# EAGLE design solar_hv4_1 (EAGLE 5.07)
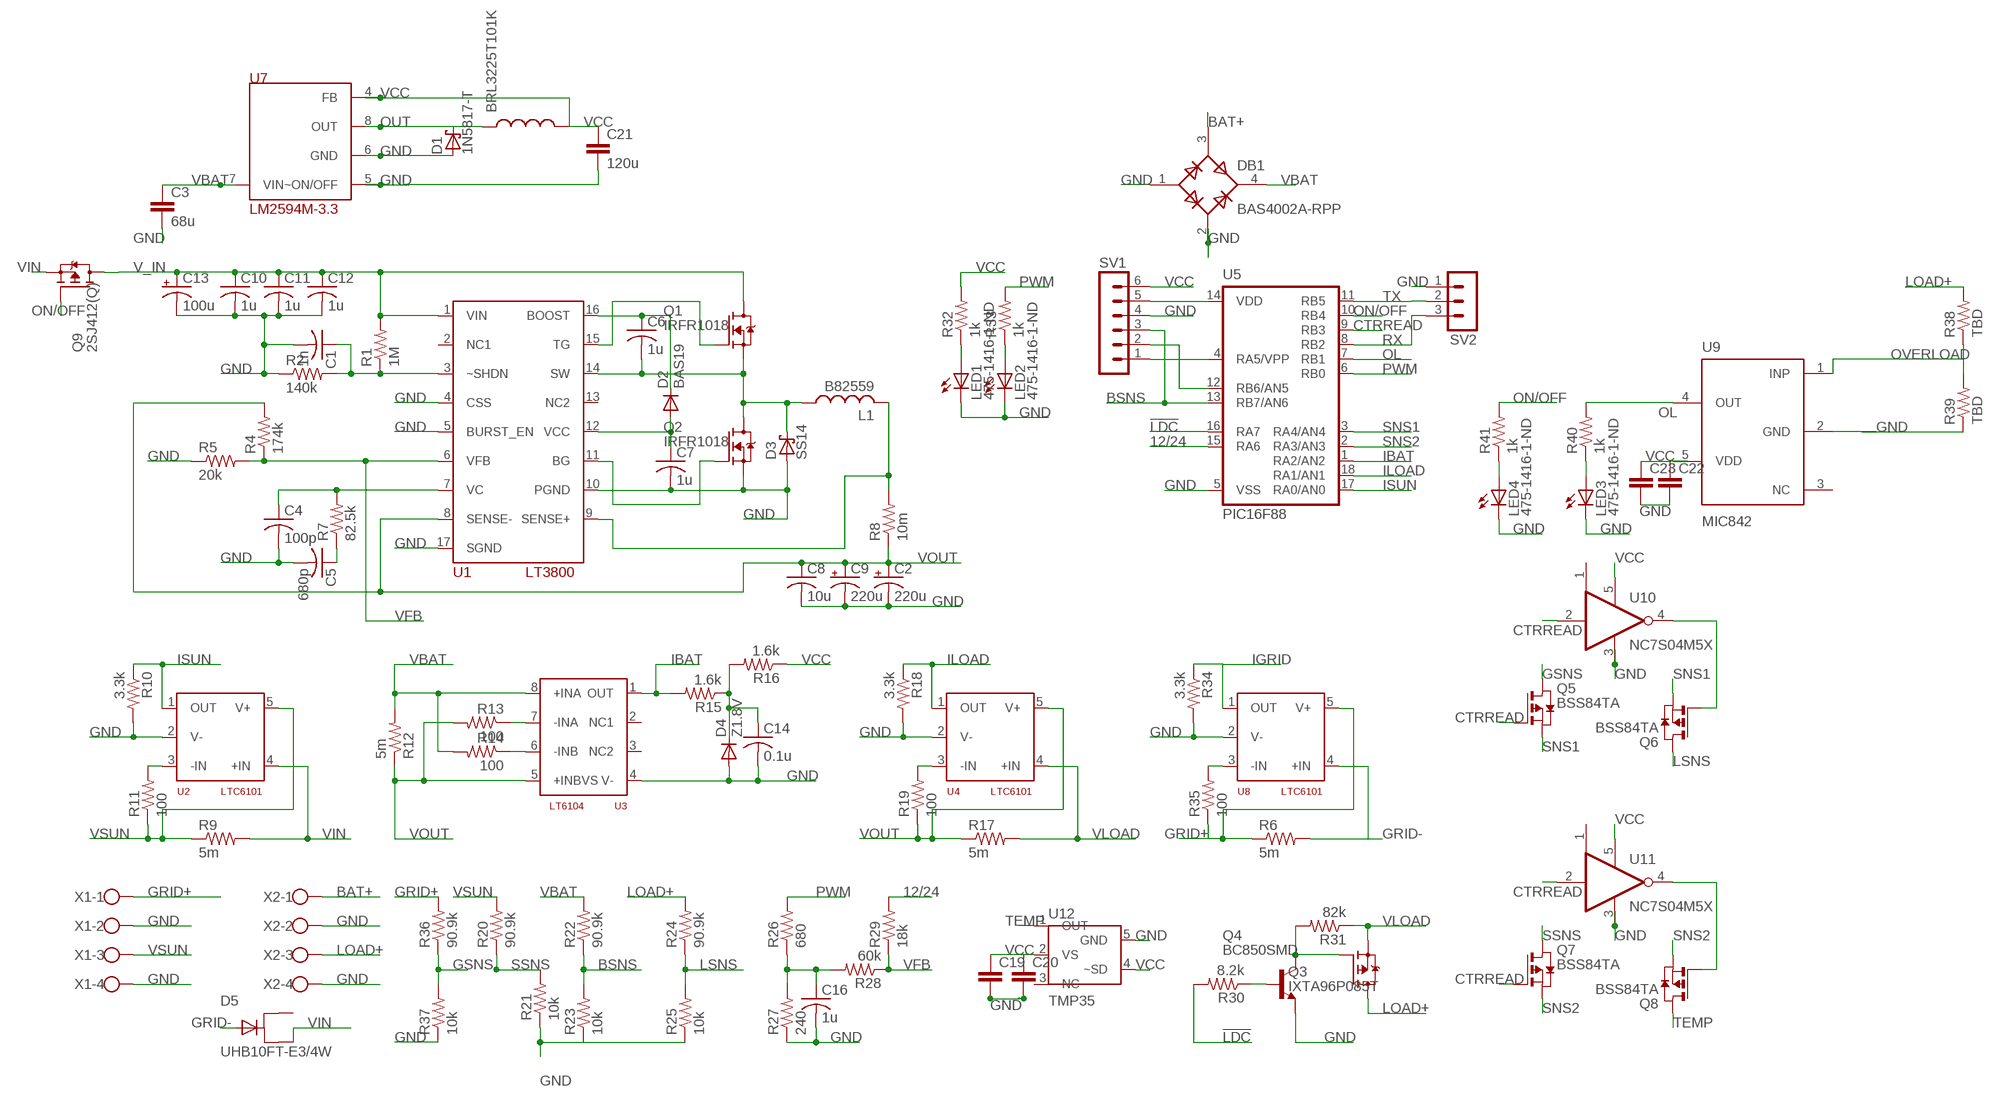
[diagram p0: schematic, sheet 1]

## Parts
BRL3225T101K  INDUCTOR1210  [1210]
C1  1n  C-USC1206  [C1206]
C2  220u  CPOL-USUD-10X10  [UD-10X10_NICHICON]
C3  68u  CAP0805  [0805]
C4  100p  C-USC1206  [C1206]
C5  680p  C-USC1206  [C1206]
C6  1u  C-USC1206  [C1206]
C7  1u  C-USC1206  [C1206]
C8  10u  C-USC1210  [C1210]
C9  220u  CPOL-USUD-10X10  [UD-10X10_NICHICON]
C10  1u  C-USC1206  [C1206]
C11  1u  C-USC1206  [C1206]
C12  1u  C-USC1206  [C1206]
C13  100u  CPOL-USG  [PANASONIC_G]
C14  0.1u  C-USC1206  [C1206]
C16  1u  C-USC1206  [C1206]
C19  CAP0805  [0805]
C20  CAP0805  [0805]
C21  120u  CAP0805  [0805]
C22  CAP0805  [0805]
C23  CAP0805  [0805]
D1  1N5817-T  [DO41-7.6]
D2  BAS19  [SOT23]
D3  SS14  [SMA]
D4  Z1.8V  DIODE-SOD123  [SOD123]
D5  UHB10FT-E3/4W  BY229B  [TO263AB]
DB1  BAS4002A-RPP  [SOT143-R]
L1  B82559  [L23X25MM]
LED1  475-1416-1-ND  LEDCHIPLED_1206  [CHIPLED_1206]
LED2  475-1416-1-ND  LEDCHIPLED_1206  [CHIPLED_1206]
LED3  475-1416-1-ND  LEDCHIPLED_1206  [CHIPLED_1206]
LED4  475-1416-1-ND  LEDCHIPLED_1206  [CHIPLED_1206]
Q1  IRFR1018  [TO252]
Q2  IRFR1018  [TO252]
Q3  IXTA96P085T  SPB80P06P  [TO263]
Q4  BC850SMD  [SOT23-BEC]
Q5  BSS84TA  [SOT-23]
Q6  BSS84TA  [SOT-23]
Q7  BSS84TA  [SOT-23]
Q8  BSS84TA  [SOT-23]
Q9  2SJ412(Q)  [TO-220]
R1  1M  R-US_R1206  [R1206]
R2  140k  R-US_R1206  [R1206]
R4  174k  R-US_R1206  [R1206]
R5  20k  R-US_R1206  [R1206]
R6  5m  FCSLXXRXXXFCSL64R005  [FCSL64-5M]
R7  82.5k  R-US_R1206  [R1206]
R8  10m  FCSLXXRXXXFCSL90R010  [FCSL90-10M]
R9  5m  FCSLXXRXXXFCSL64R005  [FCSL64-5M]
R10  3.3k  R-US_R1206  [R1206]
R11  100  R-US_R1206  [R1206]
R12  5m  FCSLXXRXXXFCSL64R005  [FCSL64-5M]
R13  100  R-US_R1206  [R1206]
R14  100  R-US_R1206  [R1206]
R15  1.6k  R-US_R1206  [R1206]
R16  1.6k  R-US_R1206  [R1206]
R17  5m  FCSLXXRXXXFCSL64R005  [FCSL64-5M]
R18  3.3k  R-US_R1206  [R1206]
R19  100  R-US_R1206  [R1206]
R20  90.9k  R-US_R1206  [R1206]
R21  10k  R-US_R1206  [R1206]
R22  90.9k  R-US_R1206  [R1206]
R23  10k  R-US_R1206  [R1206]
R24  90.9k  R-US_R1206  [R1206]
R25  10k  R-US_R1206  [R1206]
R26  680  R-US_R1206  [R1206]
R27  240  R-US_R1206  [R1206]
R28  60k  R-US_R1206  [R1206]
R29  18k  R-US_R1206  [R1206]
R30  8.2k  R-US_R1206  [R1206]
R31  82k  R-US_R1206  [R1206]
R32  1k  R-US_R1206  [R1206]
R33  1k  R-US_R1206  [R1206]
R34  3.3k  R-US_R1206  [R1206]
R35  100  R-US_R1206  [R1206]
R36  90.9k  R-US_R1206  [R1206]
R37  10k  R-US_R1206  [R1206]
R38  TBD  R-US_R1206  [R1206]
R39  TBD  R-US_R1206  [R1206]
R40  1k  R-US_R1206  [R1206]
R41  1k  R-US_R1206  [R1206]
SV1  MA06-1  [MA06-1]
SV2  MA03-1  [MA03-1]
U1  LT3800  [TSSOP16]
U2  LTC6101  LT6101  [TSOT-23-5]
U3  LT6104  LTC1604  [MSOP8]
U4  LTC6101  LT6101  [TSOT-23-5]
U5  PIC16F88  PIC16F87/88  [DIL18]
U7  LM2594M-3.3  [8-SOIC]
U8  LTC6101  LT6101  [TSOT-23-5]
U9  MIC842  [SC70-5]
U10  NC7S04M5X  [SOT23-5]
U11  NC7S04M5X  [SOT23-5]
U12  TMP35  [SOT23-5]
X1  W237-4  [W237-4]
X2  W237-4  [W237-4]

## Nets
12/24: R29.2 U5.15(RA6)
!LDC: R30.2 U5.16(RA7)
BAT+: DB1.3 X2.1
BG: Q2.1(G) U1.11(BG)
BSNS: R22.1 R23.2 SV1.3 U5.13(RB7/AN6)
CTRREAD: Q5.3(G) Q7.3(G) U5.9(RB3) U10.2(I) U11.2(I)
GND: C1.2 C2.- C3.2 C4.2 C5.2 C7.2 C8.2 C9.- C10.2 C11.2 C12.2 C13.- C14.2 C16.2 C19.2 C20.2 C21.2 C22.2 C23.2 D1.A D3.A D4.A DB1.1 DB1.2 LED1.C LED2.C LED3.C LED4.C Q2.2(S) Q4.E R2.1 R5.1 R10.2 R18.2 R21.1 R23.1 R25.1 R27.1 R34.2 R37.1 R39.1 SV1.4 SV2.1 U1.4(CSS) U1.5(BURST_EN) U1.10(PGND) U1.17(SGND) U2.2(V-) U3.4(V-) U4.2(V-) U5.5(VSS) U7.5(~ON/OFF) U7.6(GND) U8.2(V-) U9.2(GND) U10.3(GND) U11.3(GND) U12.5(GND) X1.2 X1.4 X2.2 X2.4
GRID+: R6.P$1 R35.1 R36.2 U8.5(V+) X1.1
GRID-: D5.2 R6.P$2 U8.4(+IN)
GSNS: Q5.1(D) R36.1 R37.2
IBAT: R15.2 U3.1(OUT) U5.1(RA2/AN2)
IGRID: R34.1 U8.1(OUT)
ILOAD: R18.1 U4.1(OUT) U5.18(RA1/AN1)
ISUN: R10.1 U2.1(OUT) U5.17(RA0/AN0)
LOAD+: Q3.3(D) R24.2 R38.2 X2.3
LSNS: Q6.1(D) R24.1 R25.2
N$1: L1.P$2 R8.P$2 U1.9(SENSE+)
N$2: C1.1 R1.1 R2.2 U1.3(~SHDN)
N$5: R11.2 U2.3(-IN)
N$6: C16.1 R26.1 R27.2 R28.2
N$7: C6.1 D2.3(C) U1.16(BOOST)
N$8: Q6.3(G) U10.4(O)
N$9: C4.1 R7.2 U1.7(VC)
N$10: C5.1 R7.1
N$11: C6.2 D3.K(C) L1.P$1 Q1.2(S) Q2.3(D) U1.14(SW)
N$12: Q8.3(G) U11.4(O)
N$13: C7.1 D2.1(A) U1.12(VCC)
N$14: R14.1 U3.6(-INB)
N$15: R19.2 U4.3(-IN)
N$16: R35.2 U8.3(-IN)
N$17: R13.1 U3.7(-INA)
N$18: C14.1 D4.C R15.1 R16.2
N$19: SV1.1 U5.4(RA5/VPP)
N$20: LED3.A R40.1
N$21: SV1.5 U5.14(VDD)
N$24: SV1.2 U5.12(RB6/AN5)
N$31: LED1.A R32.1
N$32: Q3.1(G) Q4.C R31.2
N$33: Q4.B R30.1
N$34: LED2.A R33.1
N$35: LED4.A R41.1
OL: R40.2 U5.7(RB1) U9.4(OUT)
ON/OFF: Q9.1(G) R41.2 U5.10(RB4)
OUT: BRL3225T101K.1 D1.C U7.8(OUT)
OVERLOAD: R38.1 R39.2 U9.1(INP)
PWM: R26.2 R33.2 U5.6(RB0)
RX: SV2.3 U5.8(RB2)
SNS1: Q5.2(S) Q6.2(S) U5.3(RA4/AN4)
SNS2: Q7.2(S) Q8.2(S) U5.2(RA3/AN3)
SSNS: Q7.1(D) R20.1 R21.2
TEMP: Q8.1(D) U12.1(OUT)
TG: Q1.1(G) U1.15(TG)
TX: SV2.2 U5.11(RB5)
V_IN: C10.1 C11.1 C12.1 C13.+ Q1.3(D) Q9.2(D) R1.2 U1.1(VIN)
VBAT: C3.1 DB1.4 R12.P$2 R14.2 R22.2 U3.8(+INA) U7.7(VIN)
VCC: BRL3225T101K.2 C19.1 C20.1 C21.1 C22.1 C23.1 R16.1 R32.2 SV1.6 U7.4(FB) U9.5(VDD) U10.5(VCC) U11.5(VCC) U12.2(VS) U12.4(~SD)
VFB: R4.1 R5.2 R28.1 R29.1 U1.6(VFB)
VIN: D5.K Q9.3(S) R9.P$2 U2.4(+IN)
VLOAD: Q3.2(S) R17.P$2 R31.1 U4.4(+IN)
VOUT: C2.+ C8.1 C9.+ R4.2 R8.P$1 R12.P$1 R13.2 R17.P$1 R19.1 U1.8(SENSE-) U3.5(+INBVS) U4.5(V+)
VSUN: R9.P$1 R11.1 R20.2 U2.5(V+) X1.3
Unconnected: D5.1 U1.2(NC1) U1.13(NC2) U3.2(NC1) U3.3(NC2) U9.3(NC) U10.1(NC) U11.1(NC) U12.3(NC)

## Library data of the parts
BRL3225T101K = SparkFun:INDUCTOR: Inductors Basic Inductor/Choke - 0603 and 1206. Footprints are not proven and vary greatly between part numbers.
C1 C4-C8 C10-C12 C14 C16 = rcl:C-US: CAPACITOR, American symbol
C2 C9 C13 = rcl:CPOL-US: POLARIZED CAPACITOR, American symbol
C3 C19-C23 = SparkFun:CAP: Capacitor Standard 0603 ceramic capacitor, and 0.1" leaded capacitor.
D1 = diode:1N581*: 1.0A SCHOTTKY BARRIER RECTIFIER Source: http://www.diodes.com/datasheets/ds23001.pdf
D2 = mylib:BAS19: Small Signal Diode
D3 = mylib:SS14: Schottky Power Rectifier SMA
D4 = diode:DIODE-: DIODE
D5 = diode:BY229B: DIODE Fast Switching Rectifier, 8A (Vishay)
DB1 = diode:BAS4002A-RPP: Diode Bridge Rectifier: Infineon
L1 = mylib:B82559: Helical Power Inductor 23mm x 25mm
LED1-LED4 = led:LED: LED OSRAM: - CHIPLED LG R971, LG N971, LY N971, LG Q971, LY Q971, LO R971, LY R971 LH N974, LH R974 LS Q976, LO Q976, LY Q976 LO Q996 - Hyper CHIPLED LW Q18S LB Q993, LB Q99A, LB R99A - SideLED LS A670, LO A670, LY A670, LG A670, LP A670 LB A673, LV A673, LT A673, LW A673 LH A674 LY A675 LS A676, LA A676, LO A676, LY A676, LW A676 LS A679, LY A679, LG A679 - Hyper Micro SIDELED® LS Y876, LA Y876, LO Y876, LY Y876 LT Y87S - SmartLED LW L88C, LW L88S LB L89C, LB L89S, LG L890 LS L89K, LO L89K, LY L89K LS L896, LA L896, LO L896, LY L896 - TOPLED LS T670, LO T670, LY T670, LG T670, LP T670 LSG T670, LSP T670, LSY T670, LOP T670, LYG T670 LG T671, LOG T671, LSG T671 LB T673, LV T673, LT T673, LW T673 LH T674 LS T676, LA T676, LO T676, LY T676, LB T676, LH T676, LSB T676, LW T676 LB T67C, LV T67C, LT T67C, LS T67K, LO T67K, LY T67K, LW E67C LS E67B, LA E67B, LO E67B, LY E67B, LB E67C, LV E67C, LT E67C LW T67C LS T679, LY T679, LG T679 LS T770, LO T770, LY T770, LG T770, LP T770 LB T773, LV T773, LT T773, LW T773 LH T774 LS E675, LA E675, LY E675, LS T675 LS T776, LA T776, LO T776, LY T776, LB T776 LHGB T686 LT T68C, LB T68C - Hyper Mini TOPLED® LB M676 - Mini TOPLED Santana® LG M470 LS M47K, LO M47K, LY M47K Source: http://www.osram.convergy.de LUXEON: - LUMILED® LXK2-PW12-R00, LXK2-PW12-S00, LXK2-PW14-U00, LXK2-PW14-V00 LXK2-PM12-R00, LXK2-PM12-S00, LXK2-PM14-U00 LXK2-PE12-Q00, LXK2-PE12-R00, LXK2-PE12-S00, LXK2-PE14-T00, LXK2-PE14-U00 LXK2-PB12-K00, LXK2-PB12-L00, LXK2-PB12-M00, LXK2-PB14-N00, LXK2-PB14-P00, LXK2-PB14-Q00 LXK2-PR12-L00, LXK2-PR12-M00, LXK2-PR14-Q00, LXK2-PR14-R00 LXK2-PD12-Q00, LXK2-PD12-R00, LXK2-PD12-S00 LXK2-PH12-R00, LXK2-PH12-S00 LXK2-PL12-P00, LXK2-PL12-Q00, LXK2-PL12-R00 Source: www.luxeon.com KINGBRIGHT: KA-3528ASYC Source: www.kingbright.com
Q1 Q2 = mylib:IRFR1018
Q3 = transistor-fet:SPB80P06P: SIPMOS (R) Power-Transistor P-Channel, Enhancement mode Source: http://www.infineon.com/upload/Document/cmc_upload/documents/011/3685/SPP80P06P.pdf
Q4 = transistor-npn:BC850*: NPN Transistor
Q5-Q8 = zetex:BSS84TA
Q9 = toshiba:2SJ412(Q)
R1 R2 R4 R5 R7 R10 R11 R13-R16 R18-R41 = rcl:R-US_: RESISTOR, American symbol
R6 R8 R9 R12 R17 = mylib:FCSLXXRXXX: Metal Foil Current Sense 10m
SV1 = con-lstb:MA06-1: PIN HEADER
SV2 = con-lstb:MA03-1: PIN HEADER
U1 = mylib:LT3800: High-Voltage Synchronous Current Mode Step-Down Controller
U2 U4 U8 = mylib:LT6101: High Voltage High-Side Current Sense Amplifier in SOT-23
U3 = mylib:LTC1604: High Voltage, High Side, Bi-Directional Current Sense Amplifier
U5 = mylib:PIC16F87/88: PIC16F87/88
U7 = national-semiconductor:LM2594M-3.3
U9 = micrel:MIC842: 1 Input Comparator with Reference
U10 U11 = fairchild-semic:NC7S04M5X: 1 INPUT INVERTER
U12 = analog-devices:TMP35: ANALOG TEMPERATURE SENSOR: VOLTAGE OUTPUT
X1 X2 = con-wago-500:W237-4: WAGO SCREW CLAMP

## Board
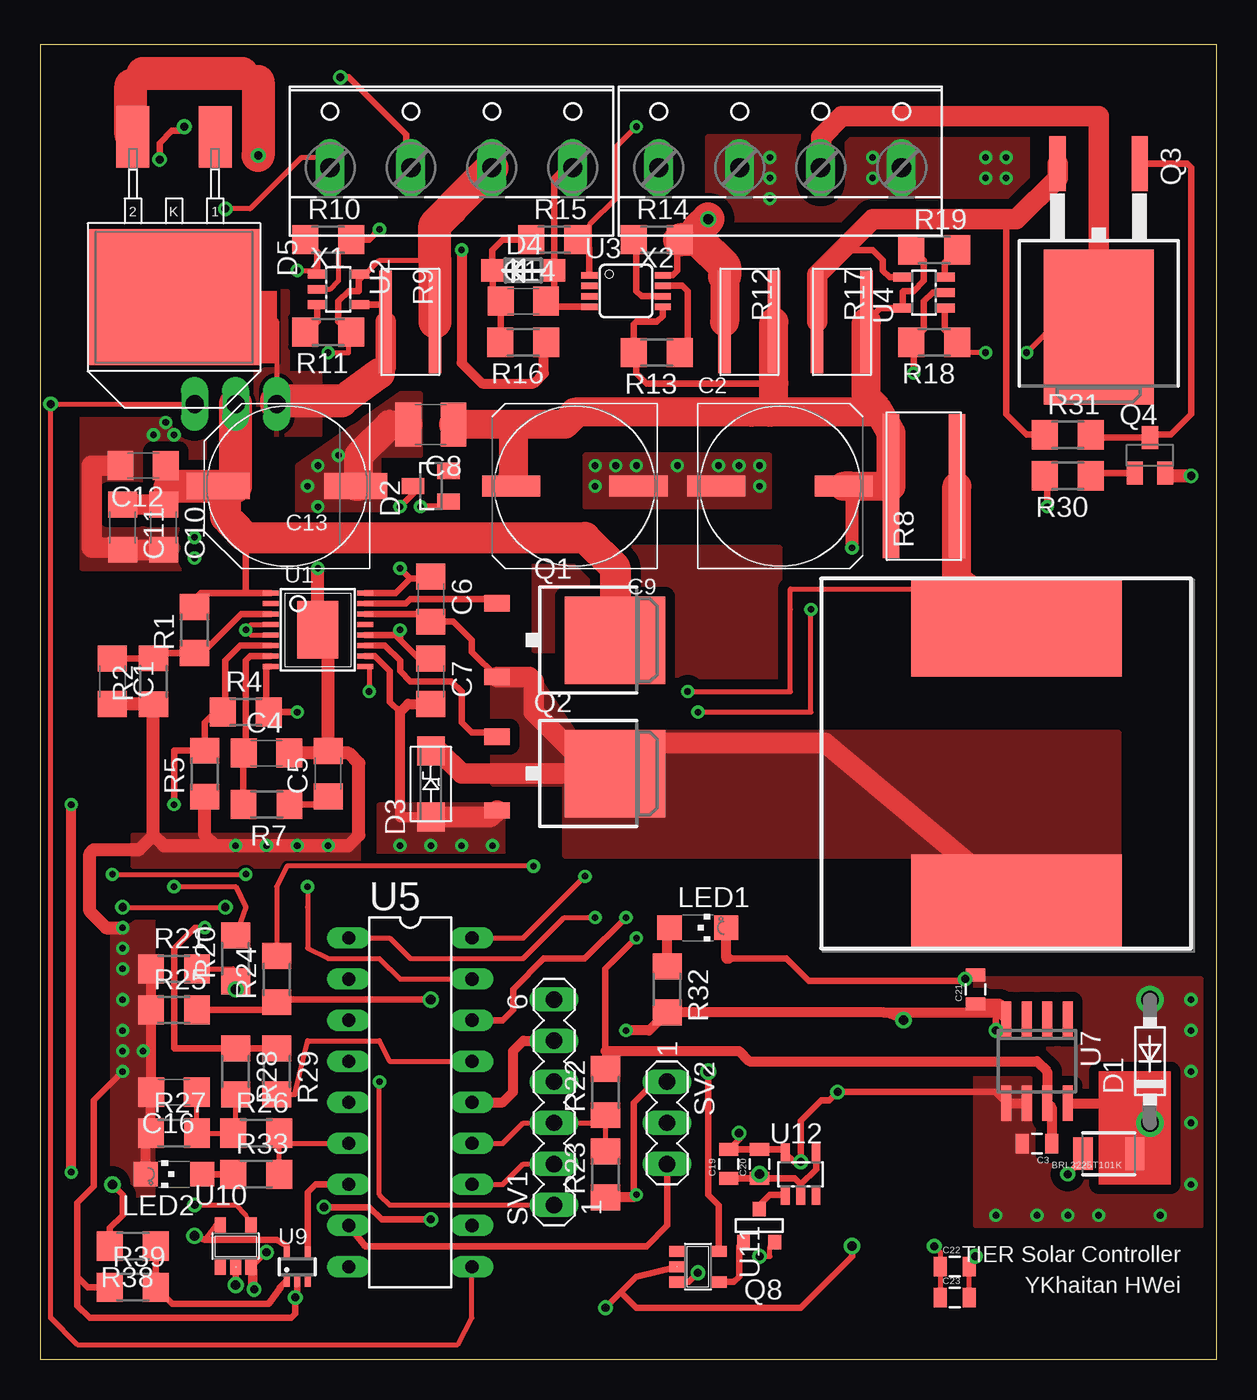
[diagram p1: board, top side]
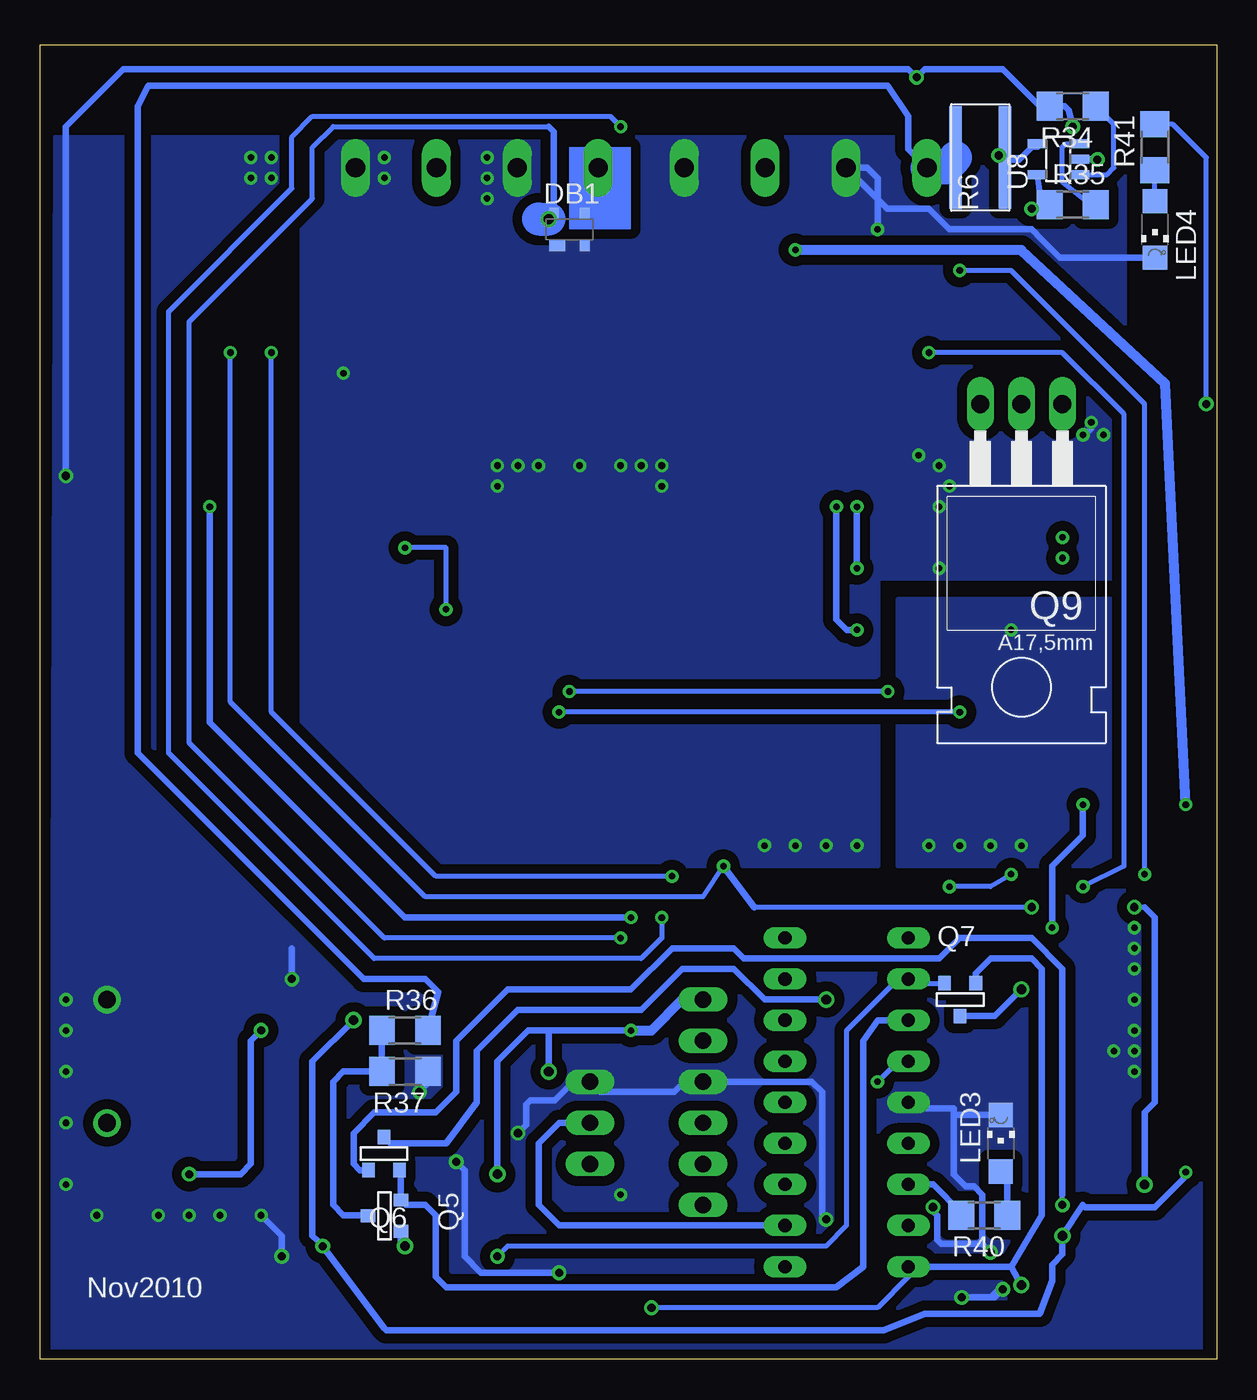
[diagram p2: board, bottom side, seen from below]

Size 72.69 x 81.27 mm. Coordinates in mm from the lower left corner, seen from the top.
Outline: 0,0 72.69,0 72.69,81.27 0,81.27 0,0
Copper layers (1*16): Top 0.035mm / dielectric 1.5mm / Bottom 0.035mm
Design rules "default *": minimum track width 10mil, minimum drill 15mil, track to track 7mil, track to pad 7mil, pad to pad 7mil, via to via 7mil, smd to smd 0mil, copper to edge 7mil, drill to drill 7mil, minimum pad ring 10mil, minimum via ring 8mil, stop-mask expansion 4mil, vias tented up to drill 0mil, thermal gap 10mil

### Footprints (pad centres in the part's own frame; a part is rotated, then mirrored left to right if it is on the bottom)
1210 = smd 1.2 x 2: 1 -1.6,0; 2 1.6,0
C1206 = smd 1.6 x 1.8: 1 -1.4,0; 2 1.4,0
UD-10X10_NICHICON = smd 3.6 x 1.3: + 3.925,0; - -3.95,0
0805 = smd 0.8 x 1.2: 1 -0.9,0; 2 0.9,0
C1210 = smd 1.6 x 2.7: 1 -1.4,0; 2 1.4,0
PANASONIC_G = smd 3.9 x 1.6: + 4.25,0; - -4.25,0
DO41-7.6 = drill 1.1 pad 1.7 round: A 3.81,0; C -3.81,0
SOT23 = smd 1 x 1.4: 1 -0.95,-1.1; 2 0.95,-1.1; 3 0,1.1
SMA = smd 1.8 x 1.7: A -2.05,0; K 2.05,0
SOD123 = smd 1.4 x 1.4: A 1.9,0; C -1.9,0
TO263AB = smd 2.032 x 3.81: 1 -2.54,0; 2 2.54,0 | smd 10.668 x 8.382: K 0,9.906
SOT143-R = smd 1 x 0.7: 1 -0.75,-1 | smd 0.6 x 0.7: 2 0.95,-1; 3 0.95,1; 4 -0.95,1
L23X25MM = smd 6 x 13: P$1 -8,0; P$2 9,0
CHIPLED_1206 = smd 1.5 x 1.5: A 0,-1.75; C 0,1.75
TO252 = smd 1 x 1.6: 1 -2.28,-6.07; 2 2.28,-6.07 | smd 5.4 x 6.2: 3 0,1.23
TO263 = smd 1 x 3.4: 1 -2.54,-6.6; 2 2.54,-6.6 | smd 6.8 x 9.6: 3 0,3.5
SOT23-BEC = smd 1 x 1.4: B -0.95,-1.1; C 0,1.1; E 0.95,-1.1
SOT-23 = smd 0.787 x 0.889: 1 0.025,-1.016; 2 -0.94,1.016; 3 0.991,1.016
TO-220 = drill 1.118 long: 1 2.54,-6.35; 2 5.08,-6.35; 3 7.62,-6.35
R1206 = smd 1.6 x 1.803: 1 -1.422,0; 2 1.422,0
FCSL64-5M = smd 0.762 x 6.35: P$1 -1.524,0; P$2 1.524,0
FCSL90-10M = smd 1.016 x 8.89: P$1 -2.032,0; P$2 2.032,0
MA06-1 = drill 1.016 long: 1 -6.35,0; 2 -3.81,0; 3 -1.27,0; 4 1.27,0; 5 3.81,0; 6 6.35,0
MA03-1 = drill 1.016 long: 1 -2.54,0; 2 0,0; 3 2.54,0
TSSOP16 = smd 0.305 x 0.991: 1 -2.275,-2.918; 2 -1.625,-2.918; 3 -0.975,-2.918; 4 -0.325,-2.918; 5 0.325,-2.918; 6 0.975,-2.918; 7 1.625,-2.918; 8 2.275,-2.918; 9 2.275,2.918; 10 1.625,2.918; 11 0.975,2.918; 12 0.325,2.918; 13 -0.325,2.918; 14 -0.975,2.918; 15 -1.625,2.918; 16 -2.275,2.918 | smd 3.556 x 2.54: 17 0,0
TSOT-23-5 = smd 0.55 x 1.2: 1 -1.05,-1.3; 2 -0.1,-1.3; 3 0.85,-1.3; 4 0.85,1.3; 5 -1.05,1.3
MSOP8 = smd 0.4 x 1: 1 -0.976,-2.263; 2 -0.326,-2.263; 3 0.324,-2.263; 4 0.974,-2.263; 5 0.974,2.262; 6 0.324,2.262; 7 -0.326,2.262; 8 -0.976,2.262
DIL18 = drill 0.813 long: 1 -10.16,-3.81; 2 -7.62,-3.81; 3 -5.08,-3.81; 4 -2.54,-3.81; 5 0,-3.81; 6 2.54,-3.81; 7 5.08,-3.81; 8 7.62,-3.81; 9 10.16,-3.81; 10 10.16,3.81; 11 7.62,3.81; 12 5.08,3.81; 13 2.54,3.81; 14 0,3.81; 15 -2.54,3.81; 16 -5.08,3.81; 17 -7.62,3.81; 18 -10.16,3.81
8-SOIC = smd 0.6 x 2.2: 1 0.635,-1.33; 2 1.905,-1.33; 3 3.175,-1.33; 4 4.445,-1.33; 5 4.445,3.87; 6 3.175,3.87; 7 1.905,3.87; 8 0.635,3.87
SC70-5 = smd 0.35 x 0.8: 1 0.62,1.69; 2 1.27,1.69; 3 1.92,1.69; 4 1.92,3.39; 5 0.62,3.39
SOT23-5 = smd 0.69 x 0.99: 1 1.59,2.52; 2 2.54,2.52; 3 3.49,2.52; 4 3.49,5.11; 5 1.59,5.11
SOT23-5' = smd 0.55 x 1.2: 1 -0.95,-1.3; 2 0,-1.3; 3 0.95,-1.3; 4 0.95,1.3; 5 -0.95,1.3
W237-4 = drill 1.194 long: 1 -7.5,-1.27; 2 -2.5,-1.27; 3 2.5,-1.27; 4 7.5,-1.27

### Placement (x,y rotation side)
BRL3225T101K  66.04,12.7 180 top
C1  4.45,41.91 270 top
C2  45.72,53.98 0 top
C3  61.6,13.34 180 top
C4  13.97,37.46 0 top
C5  17.78,36.2 90 top
C6  24.13,46.99 270 top
C7  24.13,41.91 270 top
C8  24.13,57.78 180 top
C9  33.02,53.98 180 top
C10  7.62,51.44 270 top
C11  5.08,51.44 270 top
C12  6.35,55.24 180 top
C13  15.24,53.98 180 top
C14  29.84,65.41 0 top
C16  8.26,16.51 180 top
C19  42.55,12.07 90 top
C20  44.45,12.07 90 top
C21  57.79,22.86 90 top
C22  56.52,5.71 0 top
C23  56.52,3.81 0 top
D1  68.58,18.41 90 top
D2  24.13,53.98 90 top
D3  24.13,35.56 90 top
D4  29.84,67.31 0 top
D5  8.26,75.57 180 top
DB1  40.01,69.85 0 bottom
L1  60.33,36.2 90 top
LED1  40.64,26.67 270 top
LED2  8.26,11.43 90 top
LED3  13.33,13.34 0 bottom
LED4  3.81,69.85 180 bottom
Q1  34.29,44.45 270 top
Q2  34.29,36.2 270 top
Q3  65.41,67.31 180 top
Q4  68.58,55.88 0 top
Q5  51.44,8.89 270 bottom
Q6  51.44,12.7 180 bottom
Q7  15.88,22.22 0 bottom
Q8  44.45,8.25 180 top
Q9  6.98,52.7 180 bottom
R1  9.53,45.09 90 top
R2  6.98,41.91 90 top
R4  12.7,40.01 0 top
R5  10.16,36.2 90 top
R6  14.61,74.3 0 bottom
R7  13.97,34.29 180 top
R8  54.61,53.98 0 top
R9  22.86,64.14 180 top
R10  17.78,69.22 0 top
R11  17.78,63.5 180 top
R12  43.82,64.14 180 top
R13  38.1,62.23 180 top
R14  38.1,69.22 0 top
R15  31.75,69.22 0 top
R16  29.84,62.87 180 top
R17  49.53,64.14 180 top
R18  55.25,62.87 180 top
R19  55.25,68.58 0 top
R20  12.06,24.77 90 top
R21  8.26,24.13 0 top
R22  34.93,16.51 90 top
R23  34.93,11.43 90 top
R24  14.61,23.49 90 top
R25  8.26,21.59 0 top
R26  13.33,13.97 0 top
R27  8.26,13.97 0 top
R28  12.06,17.78 270 top
R29  14.61,17.78 270 top
R30  63.5,54.61 180 top
R31  63.5,57.15 0 top
R32  38.74,22.86 270 top
R33  13.33,11.43 0 top
R34  8.89,77.47 180 bottom
R35  8.89,71.37 0 bottom
R36  50.17,20.32 0 bottom
R37  50.17,17.78 180 bottom
R38  5.71,6.99 180 top
R39  5.71,4.45 0 top
R40  14.35,8.89 180 bottom
R41  3.81,74.93 90 bottom
SV1  31.75,15.88 90 top
SV2  38.74,14.61 270 top
U1  17.14,45.09 270 top
U2  18.41,66.04 270 top
U3  36.2,66.04 270 top
U4  54.61,66.04 90 top
U5  22.86,15.88 270 top
U7  64.14,19.68 180 top
U8  9.78,74.3 90 bottom
U9  14.61,3.17 0 top
U10  9.53,3.17 0 top
U11  36.83,8.25 270 top
U12  TMP35  [SOT23-5']  46.99,11.43 0 top
X1  25.4,74.93 0 top
X2  45.72,74.93 0 top

### Tracks (layer width: path | path; a pad name or v marks a point on that pad's centre or on a via)
12/24
  Top 0.305: U5.15 21.59,18.41 20.95,19.68 16.51,19.68 15.72,16.36 R29.2
!LDC  (via drill 0.41)
  Top 0.406: U5.16 28.57,20.95 29.21,21.59 29.21,22.86 31.11,24.77 33.66,24.77 v36.2,27.3 | v62.23,52.7 62.23,55.09 R30.2
  Bottom 0.406: v36.2,27.3 50.17,27.3 62.23,39.37 v62.23,52.7
BAT+
  Bottom 0.813: X2.1 38.22,71.69 DB1.3
BG
  Top 0.406: U1.11 21.29,44.11 22.22,43.18 22.22,42.55 22.86,41.91 25.4,41.91 26.04,41.27 26.04,39.37 26.67,38.73 27.96,38.73 Q2.1
BSNS
  Top 0.305: U5.13 28.57,13.34 29.84,14.61 SV1.3 34.93,14.61 R22.1 R23.2
CTRREAD  (via drill 0.5, 0.6)
  Top 0.406: v34.93,3.17 35.88,4.13 | 35.88,4.13 36.83,5.08 U11.2 | v12.06,4.57 U10.2 | v50.17,6.99 50.17,6.35 46.99,3.17 36.83,3.17 35.88,4.13
  Bottom 0.305: U5.9 19.05,5.08 20.95,3.17 v34.93,3.17
  Bottom 0.406: Q7.3 14.88,23.85 13.97,24.77 11.43,24.77 10.79,24.13 10.79,8.89 12.7,5.71 | 12.7,5.71 U5.9 | v12.06,4.57 12.7,5.71 | Q5.3 50.42,7.24 v50.17,6.99
GND  (via drill 0.41, 0.5)
  Top 0.305: U2.2 17.88,66.14 18.41,66.68 18.41,68.43 | U1.5 13.03,44.76 v12.7,45.09 13.03,45.41 U1.4 | C23.2 C22.2
  Top 0.406: 18.41,68.43 R10.2 20.32,69.22 v20.95,69.85 | U3.4 31.58,65.07 C14.2 31.75,65.91 D4.A 31.75,73.02 32.38,73.66 X1.4 | U1.10 20.68,43.46 21.59,42.55 21.59,40.64 22.22,40.01 | 17.78,43.81 17.78,44.45 U1.17 16.82,44.76 | U4.2 55.15,65.94 54.61,65.41 54.61,63.65 R18.2 53.98,62.87 v53.98,60.96 | C22.2 57.42,5.98 v57.79,6.35 | C21.2 57.42,23.76 v57.15,23.49 57.02,23.37 47.5,23.37 46.1,24.77 42.39,24.77 | v18.54,79.25 19.05,79.25 22.61,75.69 22.61,73.95 X1.2 | v7.37,74.17 7.37,75.18 8.13,75.95 8.64,75.95 v8.89,76.2 | v43.18,13.97 43.18,13.6 C19.2 C20.2 45.8,12.96 U12.5 46.58,12.19 v46.99,12.19 46.99,14.73 48.26,16 48.77,16 v49.28,16.51 59,16.51 U7.5 | U11.3 40.07,4.77 v40.64,5.33 | R39.1 2.92,4.45 2.29,5.08 2.29,5.33 | 2.29,5.33 2.29,9.65 3.3,10.67 3.3,16 v5.08,17.78 | U9.2 15.88,3.94 v15.75,3.81 15.75,2.79 15.49,2.54 3.05,2.54 2.29,3.3 2.29,5.33 | U10.3 13.21,5.5 v13.21,4.32 13.01,4.51 U10.3 | v24.13,8.64 21.08,8.64 20.32,9.4 v17.53,9.4 | v13.97,6.6 13.92,6.6 U10.3 | Q4.E 70.95,54.78 v71.12,54.61 | 36.68,10.01 36.68,15.85 37.85,17.02 38.61,17.02 SV2.1
  Top 0.61: D3.A 22.22,33.51 22.22,40.01 22.73,40.51 C7.2 | 6.35,11.27 LED2.C 6.51,13.64 R27.1 6.83,16.49 C16.2 6.86,21.59 | 6.86,21.59 6.86,24.11 R21.1 | 6.86,21.59 R25.1 | R23.1 36.68,10.01 v36.83,10.16 | 42.55,24.77 42.39,24.77 LED1.C | U7.5 U7.6
  Top 0.813: Q4.E 69.53,54.61 v71.12,54.61 | R5.1 10.16,32.38 10.79,31.75 | 10.79,31.75 v12.06,31.75 v13.97,31.75 v15.88,31.75 v17.78,31.75 19.05,31.75 19.68,32.38 19.68,36.83 19.05,37.46 17.91,37.46 C5.2 | C4.2 17.65,37.46 C5.2 | C5.2 17.78,43.81 | C1.2 6.96,40.51 R2.1 6.98,32.38 | 6.98,32.38 7.62,31.75 10.79,31.75 | U1.17 v17.14,48.89 | v5.08,26.67 4.06,26.67 3.05,27.69 3.05,31.24 3.3,31.5 6.1,31.5 6.98,32.38
  Top 1.27: D3.A 27.82,33.51 Q2.2 | C11.2 C10.2 | 4.45,50.16 3.17,50.16 3.17,55.24 C12.2
  Top 1.778: C13.- 19.68,53.98 19.68,55.88 21.59,57.78 C8.2
  Bottom 0.406: v20.95,69.85 20.95,73.03 21.59,73.66 X1.2 20.36,71.12 17.78,71.12 16.51,69.85 12.06,69.85 11.43,69.85 10.79,69.22 9.68,68.1 LED4.C | v57.79,6.35 57.79,7.62 v59.05,8.89 | v57.15,23.49 57.15,25.4 | 7.62,74.17 7.65,74.2 U8.2 7.39,74.2 v7.37,74.17 | v8.89,76.2 9.14,77.22 9.4,77.47 R34.2 10.92,77.47 13.21,79.76 18.03,79.76 v18.54,79.25 19.05,79.76 67.56,79.76 69.34,77.98 71.12,76.2 v71.12,54.61 | v43.18,13.97 42.67,14.48 42.67,15.75 42.42,16 40.89,16 39.75,17.14 SV2.1 38.1,16.51 33.53,16.51 32.89,17.14 SV1.4 25.02,17.14 24.38,16.51 24.38,8.89 v24.13,8.64 | v40.64,5.33 45.47,5.33 46.48,6.35 46.48,11.68 v46.99,12.19 | R37.1 48.74,17.04 v49.28,16.51 | 13.97,3.81 13.72,3.81 v13.21,4.32 13.46,4.32 13.97,3.81 | 13.97,3.81 v15.75,3.81 13.97,3.81 | 16.26,14.99 16.26,11.43 15.49,10.67 14.99,10.67 14.48,10.16 14.48,7.37 14.73,7.11 | 16.26,14.99 16.26,15.49 18.67,15.49 U5.5 | v17.53,9.4 17.53,9.14 17.27,8.89 17.27,7.37 17.02,7.11 14.73,7.11 | 14.73,7.11 14.48,7.11 v13.97,6.6 | v7.75,57.91 7.75,57.53 8.13,57.15 | LED3.C 16.16,15.09 16.26,14.99
  other vias: 71.12,14.61 61.6,8.89 65.41,8.89 71.12,10.8 71.12,20.32 71.12,17.78 69.21,8.89 63.5,8.89 5.08,22.22 5.08,25.4 5.08,24.13 5.08,19.05 6.35,19.05 5.08,20.32 27.94,31.75 26.04,31.75 24.13,31.75 22.22,31.75 6.98,57.15 8.26,57.15 17.14,55.24 43.18,55.24 36.83,55.24 34.29,55.24 17.14,52.7 16.51,53.98 18.41,55.88 44.45,55.24 39.37,55.24 35.56,55.24 34.29,53.98 71.12,22.22 51.44,74.3 51.44,73.03 58.42,74.3 59.69,74.3 59.69,73.03 58.42,73.03 45.09,71.76 45.09,73.03 45.09,74.3 44.45,53.98 41.91,55.24
  pour Top (isolate 0.61, no thermals): 4.45,28.57 4.45,10.16 6.98,10.16 6.98,28.57
  pour Top (isolate 0.61, no thermals): 20.95,34.29 28.57,34.29 28.57,31.11 20.95,31.11
  pour Top (isolate 0.61, no thermals): 22.22,59.69 15.88,55.24 15.88,52.07 20.95,52.07 20.95,55.88 23.5,55.88 23.5,59.69
  pour Top (isolate 0.61, no thermals): 2.54,58.42 2.54,48.89 10.16,48.89 10.16,58.42
  pour Top (isolate 0.61, no thermals): 57.79,23.49 57.79,8.25 71.75,8.25 71.75,23.49
  pour Top (isolate 0.61, no thermals): 33.66,55.88 33.66,52.7 45.09,52.7 45.09,55.88
  pour Bottom (isolate 0.61, no thermals): 5.71,75.57 5.71,48.26 20.95,48.26 20.95,30.48 56.52,30.48 56.52,75.57
  pour Bottom (isolate 0.61, no thermals): 1.02,28.96 1.02,0.38 72.01,0.64 71.75,75.57 57.79,75.57 57.79,29.21
  pour Bottom (isolate 0.61, no thermals): 5.71,46.99 5.71,30.48 19.68,30.48 19.68,46.99
  pour Top (no thermals): 5.71,32.38 5.71,30.48 19.68,30.48 19.68,32.38
  pour Top (isolate 0.61, no thermals): 41.28,75.57 41.28,70.48 59.69,70.48 60.96,73.03 60.96,75.57
GRID+  (via drill 0.5)
  Top 0.305: v11.43,71.12 12.95,71.12 R6.P$1 17.27,74.3 X1.1
  Bottom 0.305: R35.1 10.82,71.63 U8.5 10.82,71.15 10.79,71.12 v11.43,71.12
  Bottom 0.406: R36.2 48.11,22.71 48.9,23.49 52.71,23.49 66.67,37.46 66.67,77.47 66.04,78.74 20.32,78.74 19.05,76.84 19.05,74.81 X1.1
  Bottom 2.032: X1.1 16.76,73.66 R6.P$1
GRID-  (via drill 0.5)
  Top 0.406: 12.45,79.5 13.46,78.99 | 5.59,78.74 6.35,79.5 | D5.2 5.59,75.69
  Top 2.032: 13.46,78.99 v13.46,74.42 | 6.35,79.5 12.45,79.5 | 5.59,75.69 5.59,78.74
  Bottom 0.305: R6.P$2 12.06,74.3 11.43,74.93 11.04,74.93 U8.4
  Bottom 0.406: U8.4 11.21,75.15 11.43,74.93 12.19,74.17 12.7,74.17 v13.46,74.42
GSNS
  Bottom 0.406: R36.1 R37.2 53.98,17.78 54.61,17.14 54.61,9.53 53.98,8.89 52.48,8.89 Q5.1
IBAT  (via drill 0.41)
  Top 0.305: U3.1 33.93,70.13 35.56,71.76 35.56,74.93 v36.83,76.2 | U5.1 21.59,26.04 22.86,24.77 29.84,24.77 32.38,27.3 v34.29,27.3
  Top 0.406: R15.2 33.93,68.71 U3.1
  Bottom 0.305: v36.83,76.2 37.47,76.84 55.88,76.84 57.15,75.57 57.15,72.39 64.77,64.77 64.77,37.46 52.07,24.77 35.56,24.77 34.29,26.04 v34.29,27.3
IGRID
  Bottom 0.305: U8.1 6.77,73.25 6.35,73.66 6.35,76.35 R34.1
ILOAD  (via drill 0.41)
  Top 0.305: U5.18 29.84,26.04 v33.66,29.84 | v58.42,62.23 57.15,62.23 56.67,62.71 R18.1
  Top 0.406: U4.1 55.91,63.62 R18.1
  Bottom 0.305: v33.66,29.84 48.26,29.84 58.42,40.01 v58.42,62.23
ISUN  (via drill 0.41)
  Top 0.305: v15.88,67.31 16.89,67.31 U2.1 | U5.17 22.22,23.49 20.95,24.77 17.78,24.77 16.51,25.4 16.51,27.94 v16.51,29.21 | v4.45,29.97 v12.7,29.97
  Top 0.406: U2.1 17.12,68.46 R10.1
  Bottom 0.305: v4.45,29.97 4.45,59.05 12.7,67.31 v15.88,67.31 | v16.51,29.21 13.97,29.21 v12.7,29.97
LOAD+  (via drill 0.41, 0.5, 0.6)
  Top 0.305: R24.2 14.61,29.21 15.24,30.48 v30.48,30.48 | v60.96,62.23 63.5,64.77 64.77,64.77 65.08,65.08 Q3.3 | v5.08,27.94 v11.43,27.94
  Top 0.406: R38.2 4.29,8.1 5.08,8.89 5.08,10.16 v4.45,10.8
  Top 1.27: X2.3 48.26,73.7 48.26,75.57 49.53,76.84 65.41,76.84 Q3.3
  Bottom 0.305: v30.48,30.48 31.75,28.57 48.9,28.57 60.96,40.64 v60.96,62.23 | v11.43,27.94 28.57,27.94 | 4.45,27.94 v5.08,27.94
  Bottom 0.406: v4.45,10.8 4.45,15.24 3.81,15.88 3.81,27.3 4.45,27.94 | 28.57,27.94 v30.48,30.48
LSNS  (via drill 0.6)
  Top 0.305: R24.1 14.12,21.59 R25.2
  Top 0.406: R25.2 14.61,21.59 14.61,22.22 v24.13,22.22
  Bottom 0.406: v24.13,22.22 27.94,22.22 29.84,24.13 33.02,24.13 35.56,21.59 43.18,21.59 45.72,19.05 45.72,15.88 47.62,13.34 51.08,13.34 Q6.1
N$1  (via drill 0.41)
  Top 0.305: U1.9 20.32,42.81 v20.32,41.27 | v40.01,41.27 46.36,41.27 46.36,46.35 46.36,47.62 57.68,47.62 59.72,45.75 L1.P$2
  Top 1.778: R8.P$2 56.64,48.19 59.72,45.75
  Bottom 0.305: v20.32,41.27 v40.01,41.27
N$2
  Top 0.406: C1.1 6.96,43.31 R2.2 7.32,43.66 R1.1 9.68,43.81 10.16,43.81 12.4,46.06 U1.3
N$3  (via drill 0.41)
  other vias: 9.53,49.53
N$4  (via drill 0.41)
  other vias: 9.53,50.8
N$5
  Top 0.406: U2.3 17.12,64.17 17.14,64.14 16.99,64.14 R11.2
N$6
  Top 0.305: R28.2 12.06,14.12 R26.1 R27.2 9.65,13.99 C16.1
N$7  (via drill 0.41)
  Top 0.406: U1.16 21.96,47.36 22.86,48.26 | 22.86,48.26 24,48.26 C6.1 | D2.3 23.03,53.51 v22.22,52.7 | 22.86,48.26 v22.22,48.89
  Bottom 0.406: v22.22,48.89 v22.22,52.7
N$8  (via drill 0.5)
  Top 0.305: U10.4 12.67,8.92 12.06,9.53 v9.53,9.53
  Bottom 0.305: v9.53,9.53 9.53,10.16
  Bottom 0.406: Q6.3 52.96,11.68 53.34,12.07 53.34,13.97 52.07,15.24 48.26,15.24 46.99,16.51 46.99,19.68 43.82,22.86 36.2,22.86 33.66,25.4 29.84,25.4 29.21,24.77 17.14,24.77 15.88,26.04 11.43,26.04 9.53,24.13 9.53,10.8 9.53,10.16
N$9
  Top 0.406: R7.2 12.55,37.44 C4.1 12.7,37.59 12.7,43.18 12.98,43.46 U1.7
N$10
  Top 0.406: R7.1 17.27,34.29 C5.1
N$11
  Top 0.406: U1.14 23.66,46.06 C6.2 25.53,45.59 26.67,44.45 26.67,43.72 Q1.2
  Top 1.27: Q1.2 30.22,42.17 30.48,41.91 30.48,40.01 34.29,36.2 | 34.29,36.2 Q2.3 36.2,36.2 38.1,38.1 48.52,38.1 L1.P$1 | D3.K 24.62,37.61 26.04,36.2 34.29,36.2
  pour Top (isolate 0.61, no thermals): 27.94,42.55 27.94,35.56 32.38,35.56 32.38,31.11 66.67,31.11 66.67,38.73 33.02,38.73 30.48,42.55
N$12
  Top 0.406: U11.4 42.87,4.77 43.18,5.08 43.18,6.96 Q8.3
N$13  (via drill 0.41)
  Top 0.406: U1.12 21.91,44.76 22.22,44.45 | 22.22,44.45 23.5,43.18 24,43.18 C7.1 | D2.1 24.91,52.7 v23.5,52.7 | 22.22,44.45 v22.22,45.09
  Bottom 0.406: v23.5,52.7 23.5,45.72 22.86,45.09 v22.22,45.09
N$14
  Top 0.406: U3.6 37.15,65.72 36.83,66.04 36.83,69.06 R14.1
N$15
  Top 0.406: U4.3 55.91,67.82 R19.2
N$16
  Bottom 0.305: U8.3 9.31,75.15 9.53,74.93 9.53,72.77 8.26,71.76 8.1,71.76 R35.2
N$17
  Top 0.406: U3.7 39.68,66.37 40.01,66.04 40.01,62.71 R13.1
N$18
  Top 0.406: R15.1 28.57,69.22 27.94,68.58 D4.C 27.95,65.91 C14.1 28.45,62.89 R16.2
N$19  (via drill 0.41)
  Top 0.305: SV1.1 21.59,9.53 20.95,10.16 v20.95,17.14
  Bottom 0.305: v20.95,17.14 19.68,18.41 U5.4
N$20
  Bottom 0.406: R40.1 12.93,11.18 LED3.A
N$21
  Top 0.61: U5.14 28.57,15.88 29.21,16.51 29.21,19.05 29.84,19.68 SV1.5
N$24
  Top 0.305: U5.12 28.57,10.8 29.84,12.07 SV1.2
N$31
  Top 0.61: LED1.A 38.74,26.67 R32.1
N$32
  Top 0.406: Q3.1 70.87,73.91 71.12,73.66 71.12,58.42 69.85,57.15 68.75,57.15 Q4.C 65.73,56.98 R31.2
N$33
  Top 0.406: Q4.B 65.73,54.78 R30.1
N$34
  Top 0.406: LED2.A R33.1
N$35
  Bottom 0.305: LED4.A R41.1
OL
  Top 0.406: U9.4 16.53,10.3 17.02,10.8 U5.7
  Bottom 0.406: R40.2 15.77,9.04 17.53,10.8 U5.7
ON/OFF  (via drill 0.5)
  Top 0.305: v0.64,59.05 8.89,59.05 9.53,59.69 Q9.1 v0.64,59.05 | v0.64,59.05 0.64,2.54 2.29,0.89 25.78,0.89 26.67,2.54 U5.10
  Bottom 0.305: R41.2 2.69,76.35 0.64,74.3 v0.64,59.05
OUT
  Top 0.406: D1.C 68.58,13.64 BRL3225T101K.1
  Top 0.61: U7.8 67.37,15.82 D1.C
OVERLOAD
  Top 0.406: R38.1 R39.2 8.15,3.43 14.1,3.43 14.86,4.45 14.8,4.45 U9.1
PWM
  Top 0.305: U5.6 15.24,13.34 14.76,13.82 R26.2 R33.2
RX
  Top 0.406: U5.8 20.07,6.99 22.86,6.99 37.47,6.99 38.74,8.25 SV2.3
SNS1
  Bottom 0.406: U5.3 20.95,20.95 21.84,19.68 21.84,5.71 23.5,4.45 47.62,4.45 48.26,5.08 48.26,8.89 48.9,9.53 50.11,9.53 Q5.2 50.42,11.61 Q6.2
SNS2  (via drill 0.5)
  Top 0.305: v44.45,6.35 45.09,6.35 45.09,6.93 Q8.2
  Bottom 0.305: Q7.2 18.8,23.24 U5.2 19.68,23.49 22.86,20.32 22.86,8.25 24.13,6.99 43.82,6.99 v44.45,6.35
SSNS  (via drill 0.6)
  Top 0.305: 12.06,23.49 R20.1 11.91,24.13 R21.2
  Top 0.406: R20.1 v12.06,22.86
  Bottom 0.406: Q7.1 13.72,21.21 v12.06,22.86
TEMP
  Top 0.406: Q8.1 44.43,9.5 45.09,10.16 46.01,10.16 U12.1
TG
  Top 0.406: U1.15 22.58,46.71 22.86,46.99 27.96,46.99 Q1.1
TX
  Bottom 0.406: U5.11 40.64,8.25 41.91,9.53 41.91,13.34 40.64,14.61 SV2.2
V_IN
  Top 0.305: 9.68,46.99 R1.2
  Top 0.406: 11.75,51.75 11.43,51.44 | 12.7,47.36 9.89,47.36 9.53,46.99 9.68,46.99 | 12.7,47.36 U1.1 | 12.7,50.8 12.7,47.36
  Top 1.27: 11.43,52.07 11.75,51.75 | 11.43,53.78 C13.+ 8.26,53.98 7.75,53.98 | 7.75,53.98 C12.1 | 7.75,53.98 7.62,53.98 C10.1 C11.1
  Top 1.93: Q1.3 35.52,48.94 33.66,50.8 12.7,50.8 11.75,51.75 | 11.43,53.78 11.43,52.07
  Top 2.032: Q9.2 12.06,53.98 8.26,53.98
VBAT  (via drill 0.41, 0.6)
  Top 0.406: U3.8 39.08,67.02 39.37,67.31 39.37,69.06 R14.2 39.9,68.84 | R22.2 34.93,19.05 34.93,24.13 v36.83,26.04
  Top 0.61: 34.93,19.05 43.18,19.05 43.82,18.41 61.6,18.41 62.23,17.78 U7.7 62.5,15.55 C3.1
  Top 1.778: 42.29,66.93 R12.P$2 | 40.01,69.22 R14.2 39.37,69.22
  Top 2.032: 42.29,66.93 42.29,67.56 40.64,69.22 | 40.64,69.22 R14.2 | 40.64,69.22 40.64,69.85 v41.28,70.48
  Bottom 0.305: v36.83,26.04 51.44,26.04 63.5,38.1 63.5,64.14 55.88,71.76 55.88,74.93 54.61,76.2 41.28,76.2
  Bottom 0.406: 41.91,70.48 41.32,70.48 DB1.4 40.96,75.88 41.16,76.08 41.28,76.2
  Bottom 2.032: 41.91,70.48 v41.28,70.48
VCC  (via drill 0.41, 0.5, 0.6)
  Top 0.305: U10.5 10.82,8.29 10.16,7.37 | C23.1 C22.1 55.62,6.62 v55.25,6.99
  Top 0.406: 46.99,10.8 46.62,11.16 C20.1 C19.1 44.19,11.16 v44.45,11.43 | 46.99,10.8 U12.2 | U12.4 47.94,11.75 46.99,10.8 | U11.5 41.94,9.5 41.28,10.16 v41.28,17.78 | v53.34,20.95 52.07,21.44 | U9.5 15.22,7 14.61,7.37 10.16,7.37 v9.53,7.62 | BRL3225T101K.2 64.44,12.37 v63.5,11.43 | 59.05,21.44 v59.05,20.32
  Top 0.61: R16.1 31.11,62.87 31.11,60.96 30.48,60.32 27.3,60.32 26.04,61.59 v26.04,68.58 | v1.91,11.56 v1.91,34.29 | v36.2,20.32 37.62,20.32 R32.2 52.07,21.44 59.05,21.44 59.27,21.44 U7.4 59.69,21.59 59.32,21.96 C21.1
  Bottom 0.305: v55.25,6.99 55.56,7.3
  Bottom 0.406: v44.45,11.43 44.45,18.41 42.55,20.32 41.28,20.32 | 41.28,20.32 36.83,20.32 v36.2,20.32 | 41.28,20.32 v41.28,17.78 | v53.34,20.95 55.88,18.41 55.88,7.62 55.56,7.3 v55.25,6.99 51.44,1.91 51.31,1.78 20.57,1.78 18.03,2.79 10.92,2.79 10.16,4.83 10.16,5.84 9.53,6.48 v9.53,7.62 8.26,9.53 8.13,9.4 3.81,9.4 1.91,11.3 v1.91,11.56 | v63.5,11.43 60.33,11.43 59.69,12.07 59.69,19.68 v59.05,20.32
  Bottom 0.61: v26.04,68.58 12.06,68.58 3.17,60.32 v1.91,34.29 | SV1.6 33.02,22.22 34.93,20.32 v36.2,20.32
VFB  (via drill 0.41)
  Top 0.406: U1.6 12.36,44.11 11.43,43.18 11.43,40.16 R4.1 10.79,40.01 10.16,39.37 R5.2 8.26,37.62 v8.26,34.29 | R29.1 R28.1 8.26,19.2 8.26,25.4 9.53,26.67 v10.16,26.67
  Bottom 0.406: v10.16,26.67 10.16,30.48 8.26,32.38 v8.26,34.29
VIN
  Top 0.305: D5.K 13.08,65.66 14.61,64.14 Q9.3
  Top 0.406: U2.4 21.34,65.19 R9.P$2
  Top 1.27: R9.P$2 21.34,61.34 20.95,60.96
  Top 1.93: 18.61,59.25 20.95,60.96
  Top 2.032: 18.61,59.25 14.61,59.25 Q9.3
  pour Top (isolate 0.61, no thermals): 30.48,50.16 30.48,43.81 31.75,43.81 34.29,41.27 45.72,41.27 45.72,50.16
  pour Top (isolate 0.254): 13.33,57.15 13.33,61.59 8.26,61.59 8.26,66.04 15.24,66.04 15.24,60.96 17.27,60.96 17.27,57.15
VLOAD
  Top 0.406: R31.1 60.96,57.15 59.69,58.42 59.69,70.48 | U4.4 52.49,66.89 52.07,67.31 52.07,67.95 51.44,68.58 49.53,68.58
  Top 1.27: Q3.2 62.87,73.03 60.33,70.48 59.69,70.48 51.44,70.48 49.53,68.58 48.01,67.06 R17.P$2
VOUT  (via drill 0.41)
  Top 0.305: U1.8 | v40.64,40.01 47.62,40.01 v47.62,46.35
  Top 0.406: R19.1 54.46,67.95 54.61,67.95 54.61,66.68 53.98,66.04 53.34,66.04 53.31,66.01 U4.5 51.91,64.99 R17.P$1 | 45.34,60.32 37.47,60.32 36.83,60.96 36.83,62.08 R13.2 36.68,63.98 36.83,64.14 38.1,64.14 38.46,64.49 U3.5 | U1.8 13.97,42.81 13.97,40.16 R4.2 v15.88,40.01
  Top 0.813: v50.17,50.16 50.17,53.98
  Top 1.27: 29.21,54.61 29.09,54.49 C9.+
  Top 1.778: 29.21,57.78 29.21,54.61 | 29.21,57.78 C8.1 | 45.09,58.55 33.02,58.55 33.02,58.42 32.38,57.78 29.21,57.78 | R17.P$1 51.05,59.44 51.75,58.74 | R12.P$1 45.34,60.32 45.34,58.8 45.09,58.55 | 51.75,58.74 52.58,57.28 R8.P$1 50.17,53.98 C2.+ | 45.09,58.55 51.56,58.55 51.75,58.74 | 45.09,58.55 43.94,58.55
  Bottom 0.305: v15.88,40.01 v40.64,40.01 | v47.62,46.35 47.62,50.16 v50.17,50.16
VSUN  (via drill 0.41)
  Top 0.305: v17.78,62.23 19.05,62.23 19.05,63.35 R11.1 | R20.2 12.7,27.94 12.06,29.21 v8.26,29.21 | 19.68,66.04 19.68,66.68 20.95,67.95 24.38,67.95
  Top 0.406: 19.46,67.09 U2.5 19.68,67.06 19.68,66.04 19.05,66.04 18.41,65.41 18.41,64.14 18.57,64.14 R11.1
  Top 2.032: R9.P$1 24.38,67.95 24.38,70.1 25.4,71.12 25.4,71.16 X1.3
  Bottom 0.305: v8.26,29.21 5.71,30.48 5.71,58.42 9.53,62.23 v17.78,62.23
(copper drawn outside any net)
  shapes: Bottom area x1, Top area x2

### Text on the board
tNames: TIER Solar Controller | YKhaitan HWei
bNames: Nov2010